# EAGLE schematic test (EAGLE 6.5.0)
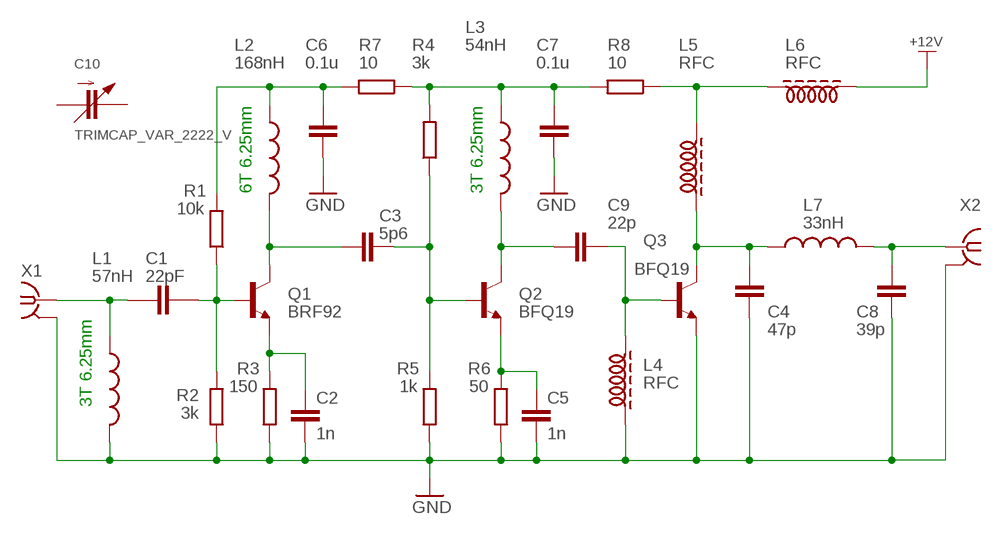
[diagram p0: schematic, sheet 1]

## Parts
C1  22pF  CAPACITOR_0805  [CAPC2012X145AN]
C2  1n  C-EU025-024X044  [C025-024X044]
C3  5p6  C-EU025-024X044  [C025-024X044]
C4  47p  C-EU025-024X044  [C025-024X044]
C5  1n  C-EU025-024X044  [C025-024X044]
C6  0.1u  C-EU025-024X044  [C025-024X044]
C7  0.1u  C-EU025-024X044  [C025-024X044]
C8  39p  C-EU025-024X044  [C025-024X044]
C9  22p  C-EU025-024X044  [C025-024X044]
C10  TRIMCAP_VAR_2222_V  [TRIMCAP_VAR_2222_V]
L1  57nH  L-US0204/5  [0204/5]
L2  168nH  L-US0204/5  [0204/5]
L3  54nH  L-US0204/5  [0204/5]
L4  RFC  Z14/40CCW  [Z15/4]
L5  RFC  Z14/40CCW  [Z15/4]
L6  RFC  Z14/40CCW  [Z15/4]
L7  33nH  L-US0204/5  [0204/5]
Q1  BRF92  -NPN-SOT23-EBC  [SOT23-EBC]
Q2  BFQ19  -NPN-SOT23-EBC  [SOT23-EBC]
Q3  BFQ19  -NPN-SOT23-EBC  [SOT23-EBC]
R1  10k  RESISTOR_0805  [RESC2012X70N]
R2  3k  RESISTOR_0805  [RESC2012X70N]
R3  150  RESISTOR_0805  [RESC2012X70N]
R4  3k  RESISTOR_0805  [RESC2012X70N]
R5  1k  RESISTOR_0805  [RESC2012X70N]
R6  50  RESISTOR_0805  [RESC2012X70N]
R7  10  RESISTOR_0805  [RESC2012X70N]
R8  10  RESISTOR_0805  [RESC2012X70N]
X1  BU-SMA-G  [BU-SMA-G]
X2  BU-SMA-G  [BU-SMA-G]

## Nets
+12V: L6.1
GND: C2.2 C4.2 C5.2 C6.2 C7.2 C8.2 L1.2 L4.1 Q3.E R2.1 R3.1 R5.1 R6.1 X1.2 X1.3 X1.4 X1.5 X2.2 X2.3 X2.4 X2.5
N$1: C2.1 Q1.E R3.2
N$2: C1.2 L1.1 X1.1
N$3: C1.1 Q1.B R1.1 R2.2
N$4: C5.1 Q2.E R6.2
N$5: C8.1 L7.2 X2.1
N$6: L5.2 L6.2 R8.1
N$9: C3.2 L2.2 Q1.C
N$10: C6.1 L2.1 R1.2 R7.2
N$11: C7.1 L3.1 R4.2 R7.1 R8.2
N$12: C4.1 L5.1 L7.1 Q3.C
N$13: C9.2 L3.2 Q2.C
N$14: C3.1 Q2.B R4.1 R5.2
N$15: C9.1 L4.2 Q3.B
Unconnected: C10.R1(R) C10.R2(R) C10.S

## Notes on the sheet
- 6T 6.25mm | 3T 6.25mm
- 3T 6.25mm

## Library data of the parts
C1 = AA-ipc-7351-capacitor:CAPACITOR_
C2-C9 = rcl:C-EU: CAPACITOR, European symbol
C10 = _RoweTel:TRIMCAP_VAR_2222_V
L1-L3 L7 = rcl:L-US: INDUCTOR, American symbol
L4-L6 = inductor-neosid:Z?CCW: CHOKE free-suspension choke/nominal inductance winding counter clockwise; OC_FARNELL: unknown; OC_NEWARK: unknown
Q1-Q3 = transistor:*-NPN-: NPN Transistror BF959 corrected 2008.03.06
R1-R8 = AA-ipc-7351-resistor:RESISTOR_
X1 X2 = con-coax:BU-SMA-G: FEMALE SMA CONNECTOR Radiall distributor RS 193-9117; OC_FARNELL: unknown; OC_NEWARK: unknown